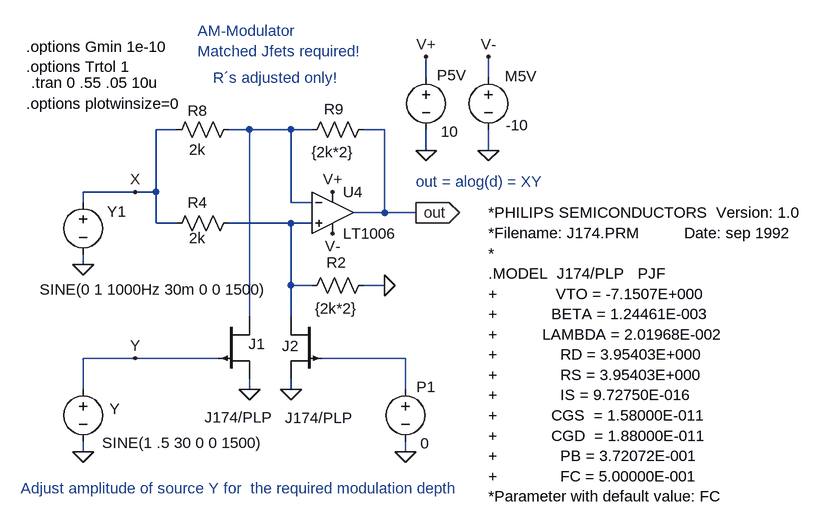
[diagram p0: schematic JFet_MultiplierTest_2b.asc]
JFet_MultiplierTest_2b.asc, the LTspice schematic file:
Version 4
SHEET 1 1932 1624
WIRE -464 432 -464 400
WIRE -368 432 -368 400
WIRE -848 512 -880 512
WIRE -736 512 -768 512
WIRE -672 512 -736 512
WIRE -640 512 -672 512
WIRE -528 512 -560 512
WIRE -464 544 -464 512
WIRE -368 544 -368 512
WIRE -912 608 -992 608
WIRE -880 608 -880 512
WIRE -880 608 -912 608
WIRE -992 624 -992 608
WIRE -672 624 -672 512
WIRE -640 624 -672 624
WIRE -528 640 -528 512
WIRE -528 640 -576 640
WIRE -480 640 -528 640
WIRE -880 656 -880 608
WIRE -848 656 -880 656
WIRE -672 656 -768 656
WIRE -640 656 -672 656
WIRE -992 720 -992 704
WIRE -672 752 -672 656
WIRE -640 752 -672 752
WIRE -528 752 -560 752
WIRE -736 800 -736 512
WIRE -672 800 -672 752
WIRE -912 864 -992 864
WIRE -784 864 -912 864
WIRE -496 864 -624 864
WIRE -992 912 -992 864
WIRE -736 912 -736 896
WIRE -672 912 -672 896
WIRE -496 912 -496 864
WIRE -992 1008 -992 992
WIRE -496 1008 -496 992
FLAG -464 544 0
FLAG -992 1008 0
FLAG -480 640 out
IOPIN -480 640 Out
FLAG -912 864 Y
FLAG -368 544 0
FLAG -736 912 0
FLAG -672 912 0
FLAG -464 400 V+
FLAG -368 400 V-
FLAG -608 608 V+
FLAG -608 672 V-
FLAG -992 720 0
FLAG -912 608 X
FLAG -528 752 0
FLAG -496 1008 0
SYMBOL voltage -464 416 R0
WINDOW 123 0 0 Left 0
WINDOW 39 0 0 Left 0
WINDOW 3 23 99 Left 0
WINDOW 0 17 12 Left 0
SYMATTR Value 10
SYMATTR InstName P5V
SYMBOL voltage -992 896 R0
WINDOW 3 29 98 Left 0
WINDOW 123 0 0 Left 0
WINDOW 39 0 0 Left 0
WINDOW 0 41 46 Left 0
SYMATTR Value SINE(1 .5 30 0 0 1500)
SYMATTR InstName Y
SYMBOL voltage -368 416 R0
WINDOW 123 0 0 Left 0
WINDOW 39 0 0 Left 0
WINDOW 3 27 89 Left 0
WINDOW 0 25 14 Left 0
SYMATTR Value -10
SYMATTR InstName M5V
SYMBOL Opamps\\LT1006 -608 576 R0
SYMATTR InstName U4
SYMBOL pjf -784 800 R0
WINDOW 0 47 42 Left 0
WINDOW 3 103 156 Left 0
SYMATTR InstName J1
SYMATTR Value J174/PLP
SYMBOL pjf -624 800 M0
WINDOW 0 36 45 Left 0
WINDOW 3 77 155 Left 0
SYMATTR InstName J2
SYMATTR Value J174/PLP
SYMBOL res -656 768 R270
WINDOW 0 36 54 VTop 0
WINDOW 3 -4 53 VBottom 0
SYMATTR InstName R2
SYMATTR Value {2k*2}
SYMATTR SpiceLine tol=1 pwr=0.1
SYMBOL res -864 672 R270
WINDOW 0 32 48 VTop 0
WINDOW 3 9 48 VBottom 0
SYMATTR InstName R4
SYMATTR Value 2k
SYMATTR SpiceLine tol=1 pwr=0.1
SYMBOL res -864 528 R270
WINDOW 0 30 48 VTop 0
WINDOW 3 1 48 VBottom 0
SYMATTR InstName R8
SYMATTR Value 2k
SYMATTR SpiceLine tol=1 pwr=0.1
SYMBOL res -656 528 R270
WINDOW 0 32 50 VTop 0
WINDOW 3 -3 48 VBottom 0
SYMATTR InstName R9
SYMATTR Value {2k*2}
SYMATTR SpiceLine tol=1 pwr=0.1
SYMBOL voltage -992 608 R0
WINDOW 3 -67 150 Left 0
WINDOW 123 0 0 Left 0
WINDOW 39 0 0 Left 0
WINDOW 0 37 30 Left 0
SYMATTR Value SINE(0 1 1000Hz 30m 0 0 1500)
SYMATTR InstName Y1
SYMBOL voltage -496 896 R0
WINDOW 123 0 0 Left 0
WINDOW 39 0 0 Left 0
WINDOW 3 23 99 Left 0
WINDOW 0 17 12 Left 0
SYMATTR Value 0
SYMATTR InstName P1
TEXT -480 592 Left 0 ;out = alog(d) = XY
TEXT -1080 384 Left 0 !.options Gmin 1e-10\n.options Trtol 1
TEXT -1072 440 Left 0 !.tran 0 .55 .05 10u
TEXT -368 640 Left 0 !*PHILIPS SEMICONDUCTORS  Version: 1.0\n*Filename: J174.PRM          Date: sep 1992\n*\n.MODEL  J174/PLP   PJF\n+             VTO = -7.1507E+000\n+            BETA = 1.24461E-003\n+          LAMBDA = 2.01968E-002\n+              RD = 3.95403E+000\n+              RS = 3.95403E+000\n+              IS = 9.72750E-016\n+            CGS  = 1.58000E-011\n+            CGD  = 1.88000E-011\n+              PB = 3.72072E-001\n+              FC = 5.00000E-001\n*Parameter with default value: FC
TEXT -792 432 Left 0 ;R´s adjusted only!
TEXT -1080 472 Left 0 !.options plotwinsize=0
TEXT -1088 1064 Left 0 ;Adjust amplitude of source Y for  the required modulation depth
TEXT -816 360 Left 0 ;AM-Modulator\nMatched Jfets required!

The netlist it stands for:
* JFet_MultiplierTest_2b.asc
V§P5V V+ 0 10
V§Y Y 0 SINE(1 .5 30 0 0 1500)
V§M5V V- 0 -10
XU4 N002 N001 V+ V- out LT1006  ; pins In+ In- V+ V- OUT
J1 N001 Y 0 J174/PLP
J2 N002 N003 0 J174/PLP
R2 N002 0 {2k*2} tol=1 pwr=0.1
R4 X N002 2k tol=1 pwr=0.1
R8 X N001 2k tol=1 pwr=0.1
R9 N001 out {2k*2} tol=1 pwr=0.1
V§Y1 X 0 SINE(0 1 1000Hz 30m 0 0 1500)
V§P1 N003 0 0
.model NJF NJF
.model PJF PJF
.lib standard.jft
* out = alog(d) = XY
.options Gmin 1e-10
.options Trtol 1
.tran 0 .55 .05 10u
*PHILIPS SEMICONDUCTORS  Version: 1.0
*Filename: J174.PRM          Date: sep 1992
*
.MODEL  J174/PLP   PJF
+             VTO = -7.1507E+000
+            BETA = 1.24461E-003
+          LAMBDA = 2.01968E-002
+              RD = 3.95403E+000
+              RS = 3.95403E+000
+              IS = 9.72750E-016
+            CGS  = 1.58000E-011
+            CGD  = 1.88000E-011
+              PB = 3.72072E-001
+              FC = 5.00000E-001
*Parameter with default value: FC
* R´s adjusted only!
.options plotwinsize=0
* Adjust amplitude of source Y for  the required modulation depth
* AM-Modulator
* Matched Jfets required!
.lib LTC.lib
.backanno
.end